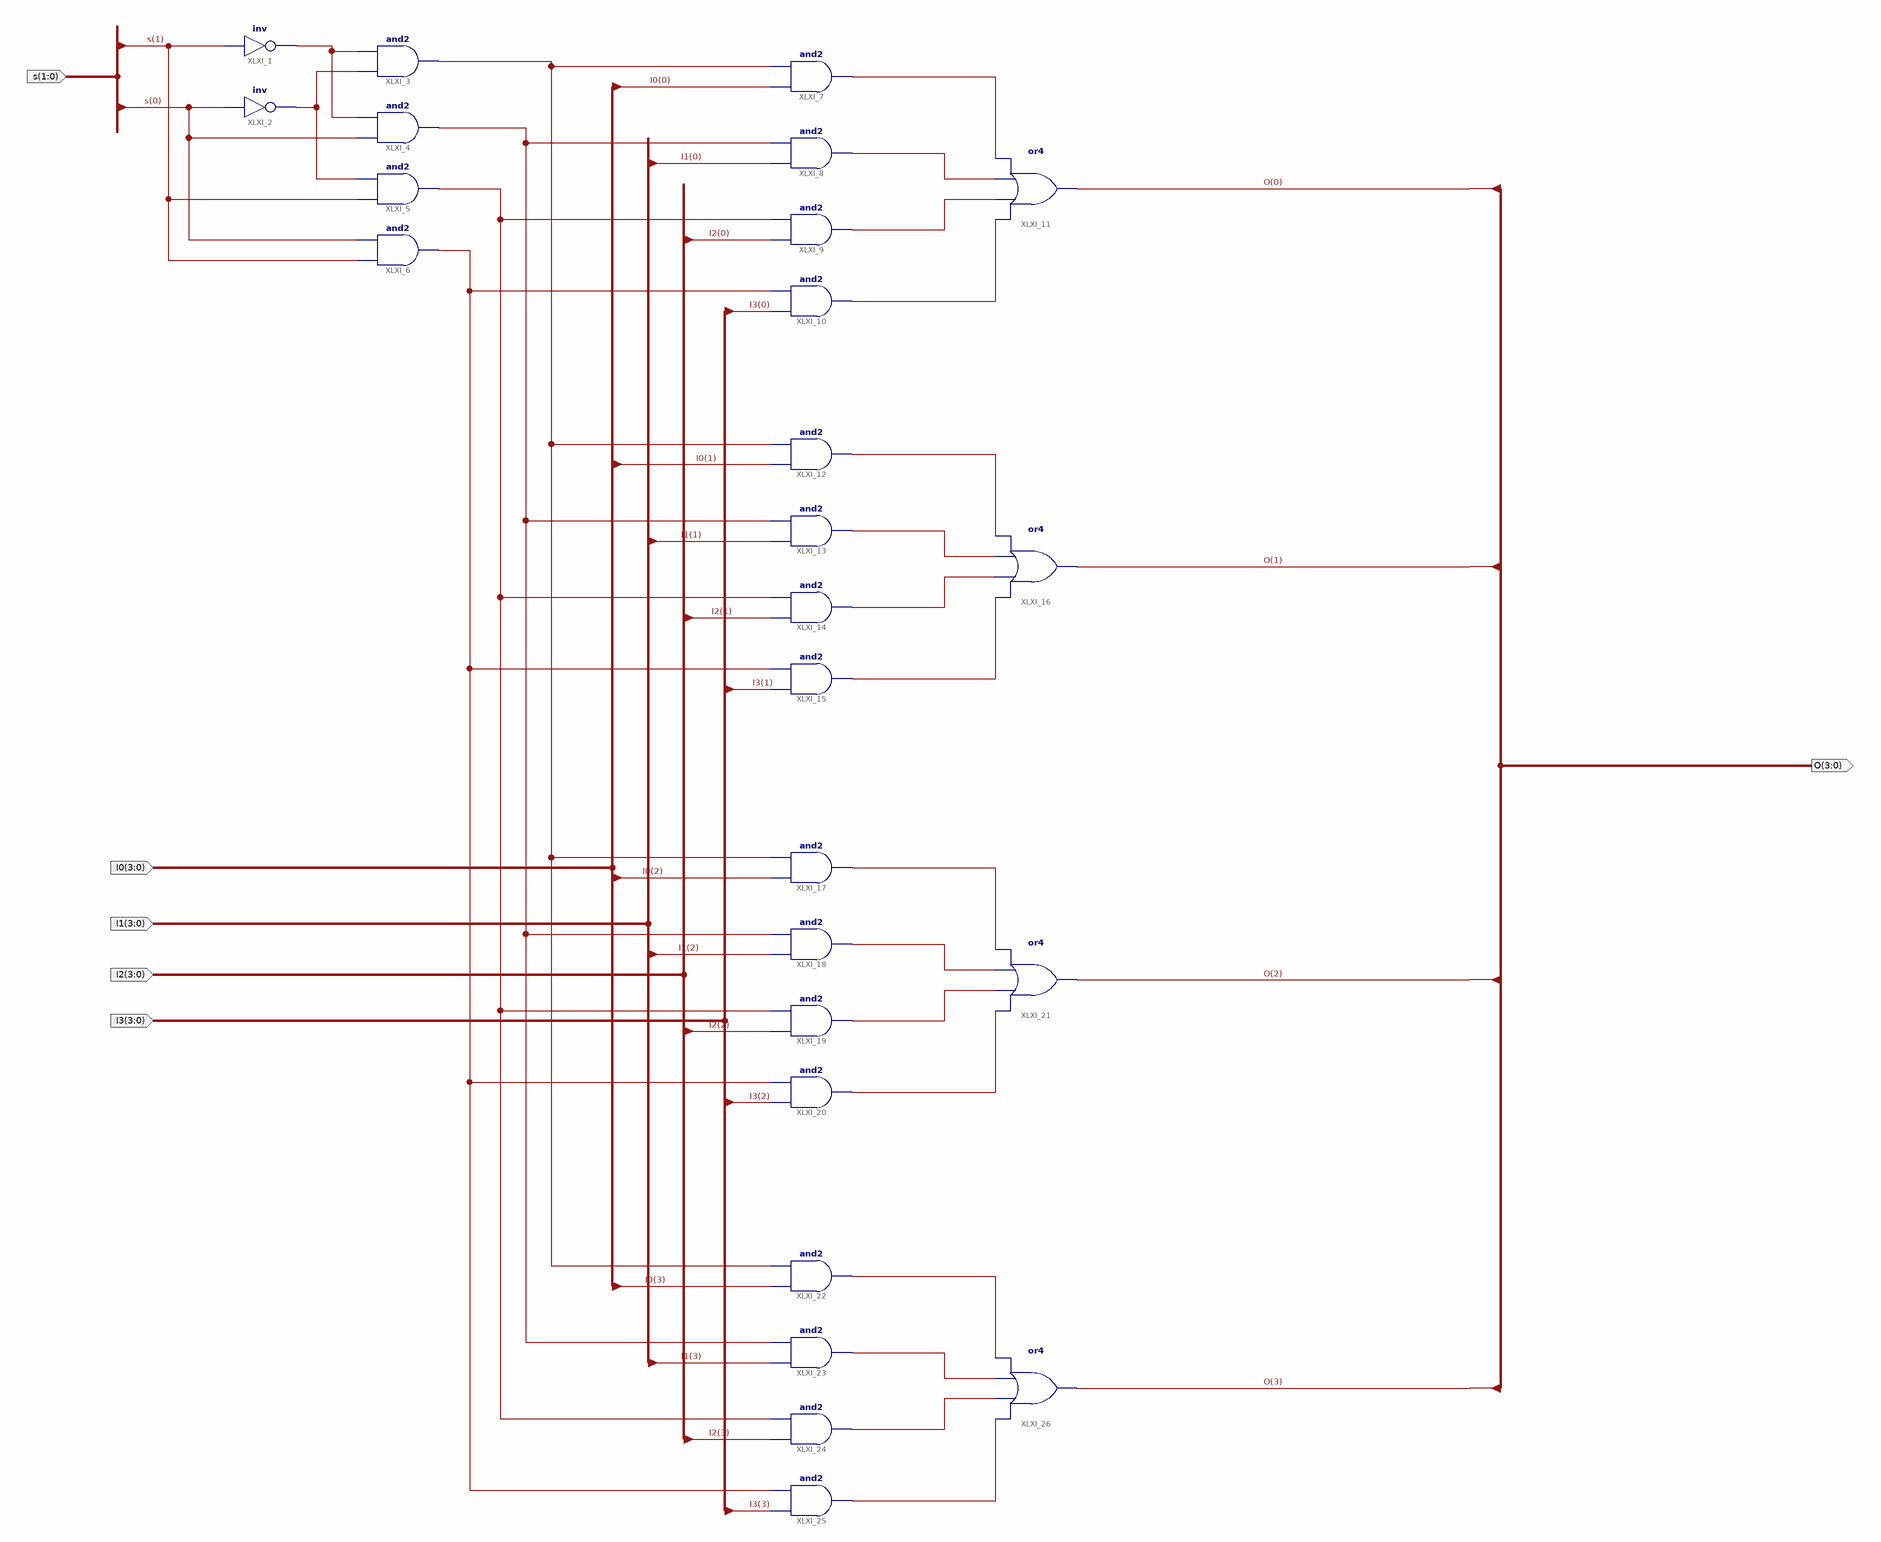
[diagram p0: schematic sheet 1]
// Xilinx ISE schematic Mux4to1b4.sch (kintex7) as structural Verilog: 26 symbols, 6 ports
module Mux4to1b4 (
  input  [1:0] s,
  input  [3:0] I0,
  input  [3:0] I1,
  input  [3:0] I2,
  input  [3:0] I3,
  output [3:0] O
);

  wire XLXN_4, XLXN_5, XLXN_7, XLXN_8, XLXN_9, XLXN_10, XLXN_11, XLXN_12, XLXN_13, XLXN_14, XLXN_15, XLXN_16,
       XLXN_17, XLXN_18, XLXN_19, XLXN_20, XLXN_21, XLXN_22, XLXN_27, XLXN_28, XLXN_29, XLXN_30;

  not XLXI_1 (XLXN_4, s[1]);
  not XLXI_2 (XLXN_5, s[0]);
  and XLXI_3 (XLXN_27, XLXN_5, XLXN_4);
  and XLXI_4 (XLXN_28, s[0], XLXN_4);
  and XLXI_5 (XLXN_29, s[1], XLXN_5);
  and XLXI_6 (XLXN_30, s[1], s[0]);
  and XLXI_7 (XLXN_7, I0[0], XLXN_27);
  and XLXI_8 (XLXN_9, I1[0], XLXN_28);
  and XLXI_9 (XLXN_10, I2[0], XLXN_29);
  and XLXI_10 (XLXN_8, I3[0], XLXN_30);
  or XLXI_11 (O[0], XLXN_8, XLXN_10, XLXN_9, XLXN_7);
  and XLXI_12 (XLXN_11, I0[1], XLXN_27);
  and XLXI_13 (XLXN_13, I1[1], XLXN_28);
  and XLXI_14 (XLXN_14, I2[1], XLXN_29);
  and XLXI_15 (XLXN_12, I3[1], XLXN_30);
  or XLXI_16 (O[1], XLXN_12, XLXN_14, XLXN_13, XLXN_11);
  and XLXI_17 (XLXN_15, I0[2], XLXN_27);
  and XLXI_18 (XLXN_17, I1[2], XLXN_28);
  and XLXI_19 (XLXN_18, I2[2], XLXN_29);
  and XLXI_20 (XLXN_16, I3[2], XLXN_30);
  or XLXI_21 (O[2], XLXN_16, XLXN_18, XLXN_17, XLXN_15);
  and XLXI_22 (XLXN_19, I0[3], XLXN_27);
  and XLXI_23 (XLXN_21, I1[3], XLXN_28);
  and XLXI_24 (XLXN_22, I2[3], XLXN_29);
  and XLXI_25 (XLXN_20, I3[3], XLXN_30);
  or XLXI_26 (O[3], XLXN_20, XLXN_22, XLXN_21, XLXN_19);
endmodule
